# EAGLE design High Fructose (EAGLE 6.4)

## Sheet 1 of 5
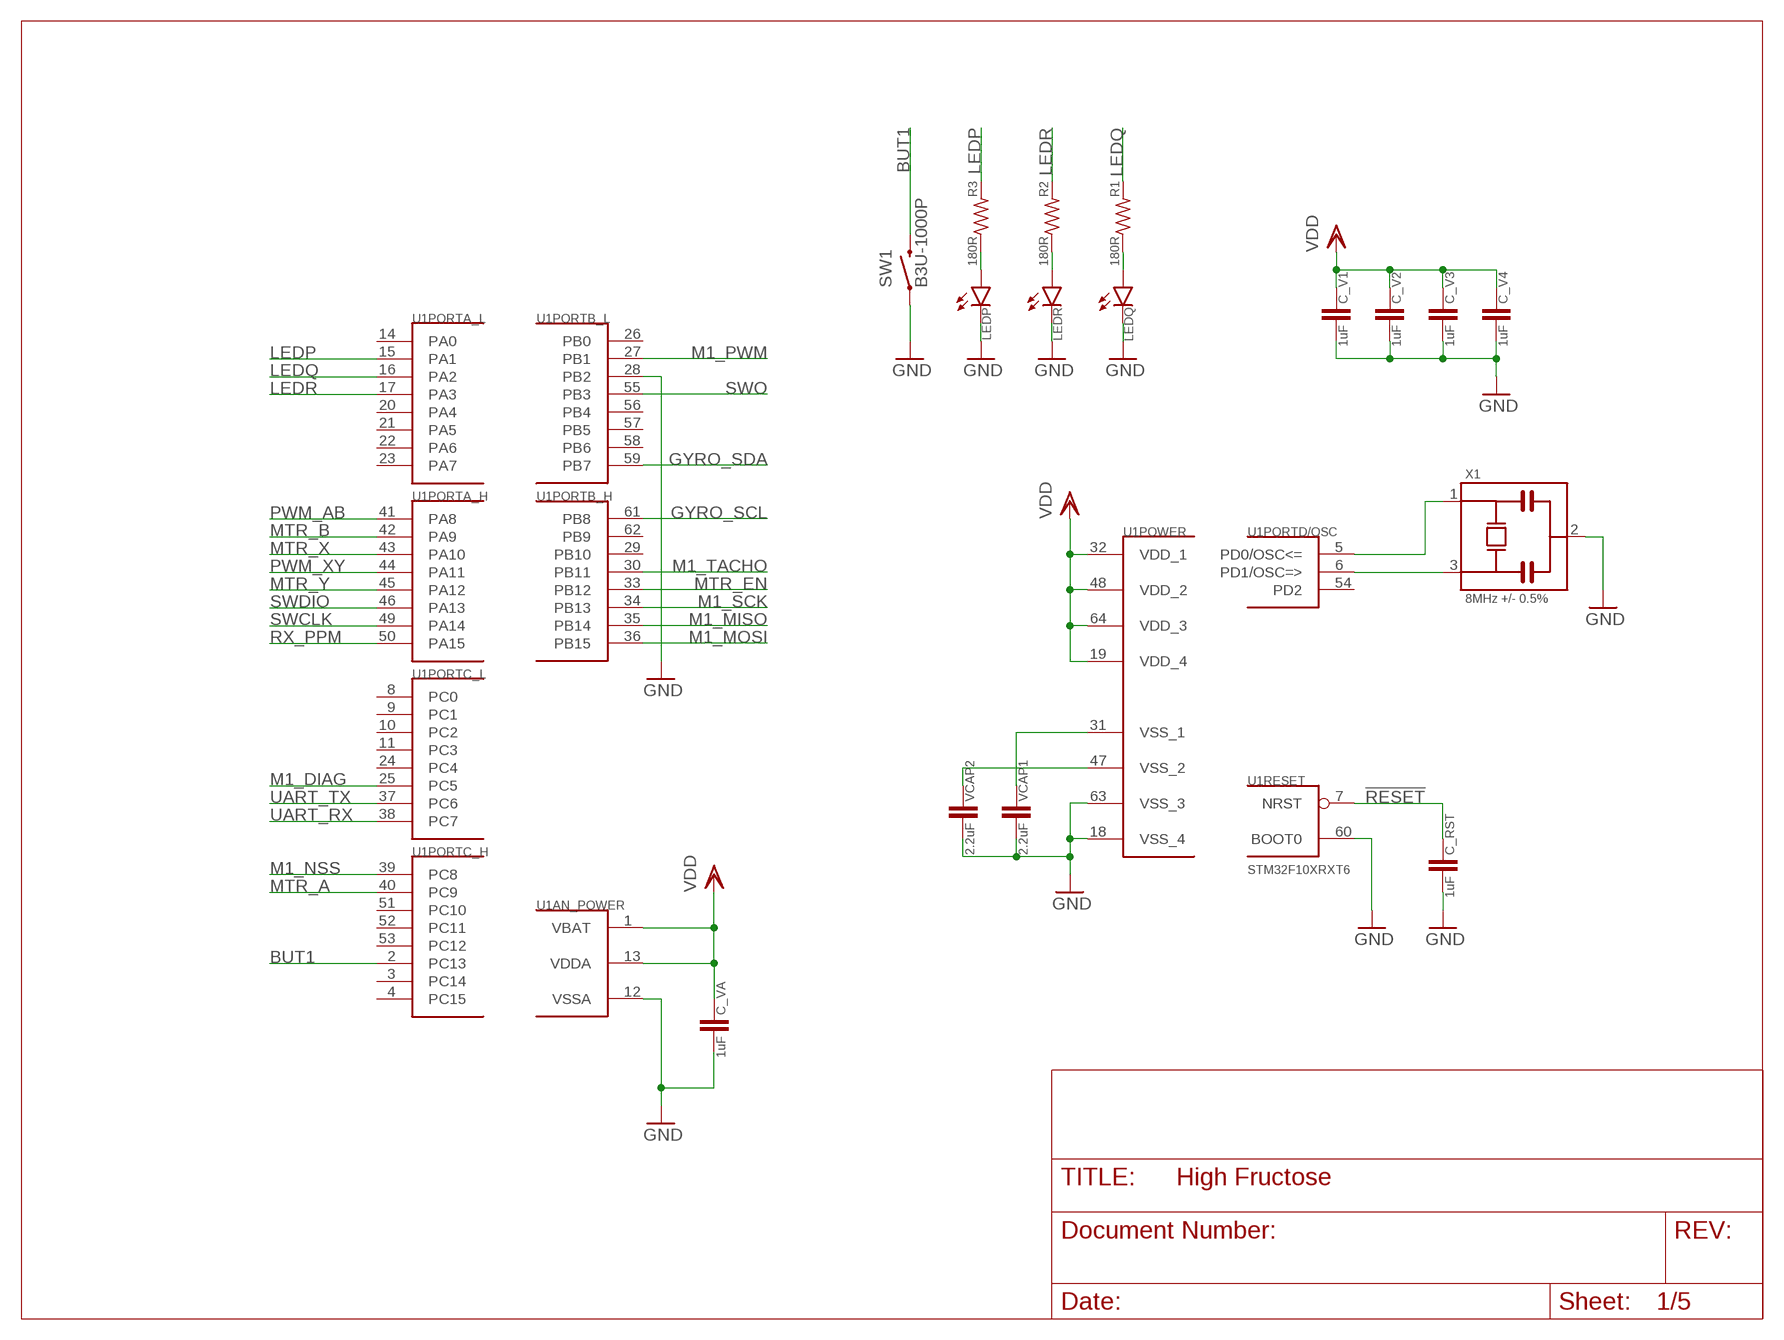
[diagram p0: schematic, sheet 1]

### Parts
C_RST  1uF  C0603  [0603]
C_V1  1uF  C0603  [0603]
C_V2  1uF  C0603  [0603]
C_V3  1uF  C0603  [0603]
C_V4  1uF  C0603  [0603]
C_VA  1uF  C0603  [0603]
LEDP  LED0805  [0805_POL]
LEDQ  LED0805  [0805_POL]
LEDR  LED0805  [0805_POL]
R1  180R  R0603  [0603]
R2  180R  R0603  [0603]
R3  180R  R0603  [0603]
SW1  B3U-1000P  SWITCH_SPST-NOB3U-1000P  [B3U-1000P]
U1  STM32F10XRXT6  [TQFP64]
VCAP1  2.2uF  C0603  [0603]
VCAP2  2.2uF  C0603  [0603]
X1  8MHz +/- 0.5%  MURATA_CSTCE  [MURATA_CSTCE]

### Nets
!RESET: C_RST.1 U1.7(RESET:NRST) ; also sheet 4,5
BUT1: SW1.2 U1.2(PORTC_H:PC13)
GND: C_RST.2 C_V1.2 C_V2.2 C_V3.2 C_V4.2 C_VA.2 LEDP.-(C) LEDQ.-(C) LEDR.-(C) SW1.1 U1.12(AN_POWER:VSSA) U1.18(POWER:VSS_4) U1.28(PORTB_L:PB2) U1.60(RESET:BOOT0) U1.63(POWER:VSS_3) VCAP1.2 VCAP2.2 X1.2 ; also sheet 2,4,5
GYRO_SCL: U1.61(PORTB_H:PB8) ; also sheet 5
GYRO_SDA: U1.59(PORTB_L:PB7) ; also sheet 5
LEDP: R3.2 U1.15(PORTA_L:PA1)
LEDQ: R1.2 U1.16(PORTA_L:PA2)
LEDR: R2.2 U1.17(PORTA_L:PA3)
M1_DIAG: U1.25(PORTC_L:PC5) ; also sheet 2
M1_MISO: U1.35(PORTB_H:PB14) ; also sheet 2
M1_MOSI: U1.36(PORTB_H:PB15) ; also sheet 2
M1_NSS: U1.39(PORTC_H:PC8) ; also sheet 2
M1_PWM: U1.27(PORTB_L:PB1) ; also sheet 2
M1_SCK: U1.34(PORTB_H:PB13) ; also sheet 2
M1_TACHO: U1.30(PORTB_H:PB11) ; also sheet 2
MTR_A: U1.40(PORTC_H:PC9) ; also sheet 3
MTR_B: U1.42(PORTA_H:PA9) ; also sheet 3
MTR_EN: U1.33(PORTB_H:PB12) ; also sheet 3
MTR_X: U1.43(PORTA_H:PA10) ; also sheet 3
MTR_Y: U1.45(PORTA_H:PA12) ; also sheet 3
N$1: U1.6(PORTD/OSC:PD1/OSC=>) X1.3
N$2: U1.5(PORTD/OSC:PD0/OSC<=) X1.1
N$3: U1.47(POWER:VSS_2) VCAP2.1
N$4: U1.31(POWER:VSS_1) VCAP1.1
N$5: LEDQ.+(A) R1.1
N$11: LEDP.+(A) R3.1
N$35: LEDR.+(A) R2.1
PWM_AB: U1.41(PORTA_H:PA8) ; also sheet 3
PWM_XY: U1.44(PORTA_H:PA11) ; also sheet 3
RX_PPM: U1.50(PORTA_H:PA15) ; also sheet 5
SWCLK: U1.49(PORTA_H:PA14) ; also sheet 5
SWDIO: U1.46(PORTA_H:PA13) ; also sheet 5
SWO: U1.55(PORTB_L:PB3) ; also sheet 5
UART_RX: U1.38(PORTC_L:PC7) ; also sheet 5
UART_TX: U1.37(PORTC_L:PC6) ; also sheet 5
VDD: C_V1.1 C_V2.1 C_V3.1 C_V4.1 C_VA.1 U1.1(AN_POWER:VBAT) U1.13(AN_POWER:VDDA) U1.19(POWER:VDD_4) U1.32(POWER:VDD_1) U1.48(POWER:VDD_2) U1.64(POWER:VDD_3) ; also sheet 2,4,5
Unconnected: U1.3(PORTC_H:PC14) U1.4(PORTC_H:PC15) U1.8(PORTC_L:PC0) U1.9(PORTC_L:PC1) U1.10(PORTC_L:PC2) U1.11(PORTC_L:PC3) U1.14(PORTA_L:PA0) U1.20(PORTA_L:PA4) U1.21(PORTA_L:PA5) U1.22(PORTA_L:PA6) U1.23(PORTA_L:PA7) U1.24(PORTC_L:PC4) U1.26(PORTB_L:PB0) U1.29(PORTB_H:PB10) U1.51(PORTC_H:PC10) U1.52(PORTC_H:PC11) U1.53(PORTC_H:PC12) U1.54(PORTD/OSC:PD2) U1.56(PORTB_L:PB4) U1.57(PORTB_L:PB5) U1.58(PORTB_L:PB6) U1.62(PORTB_H:PB9)

## Sheet 2 of 5
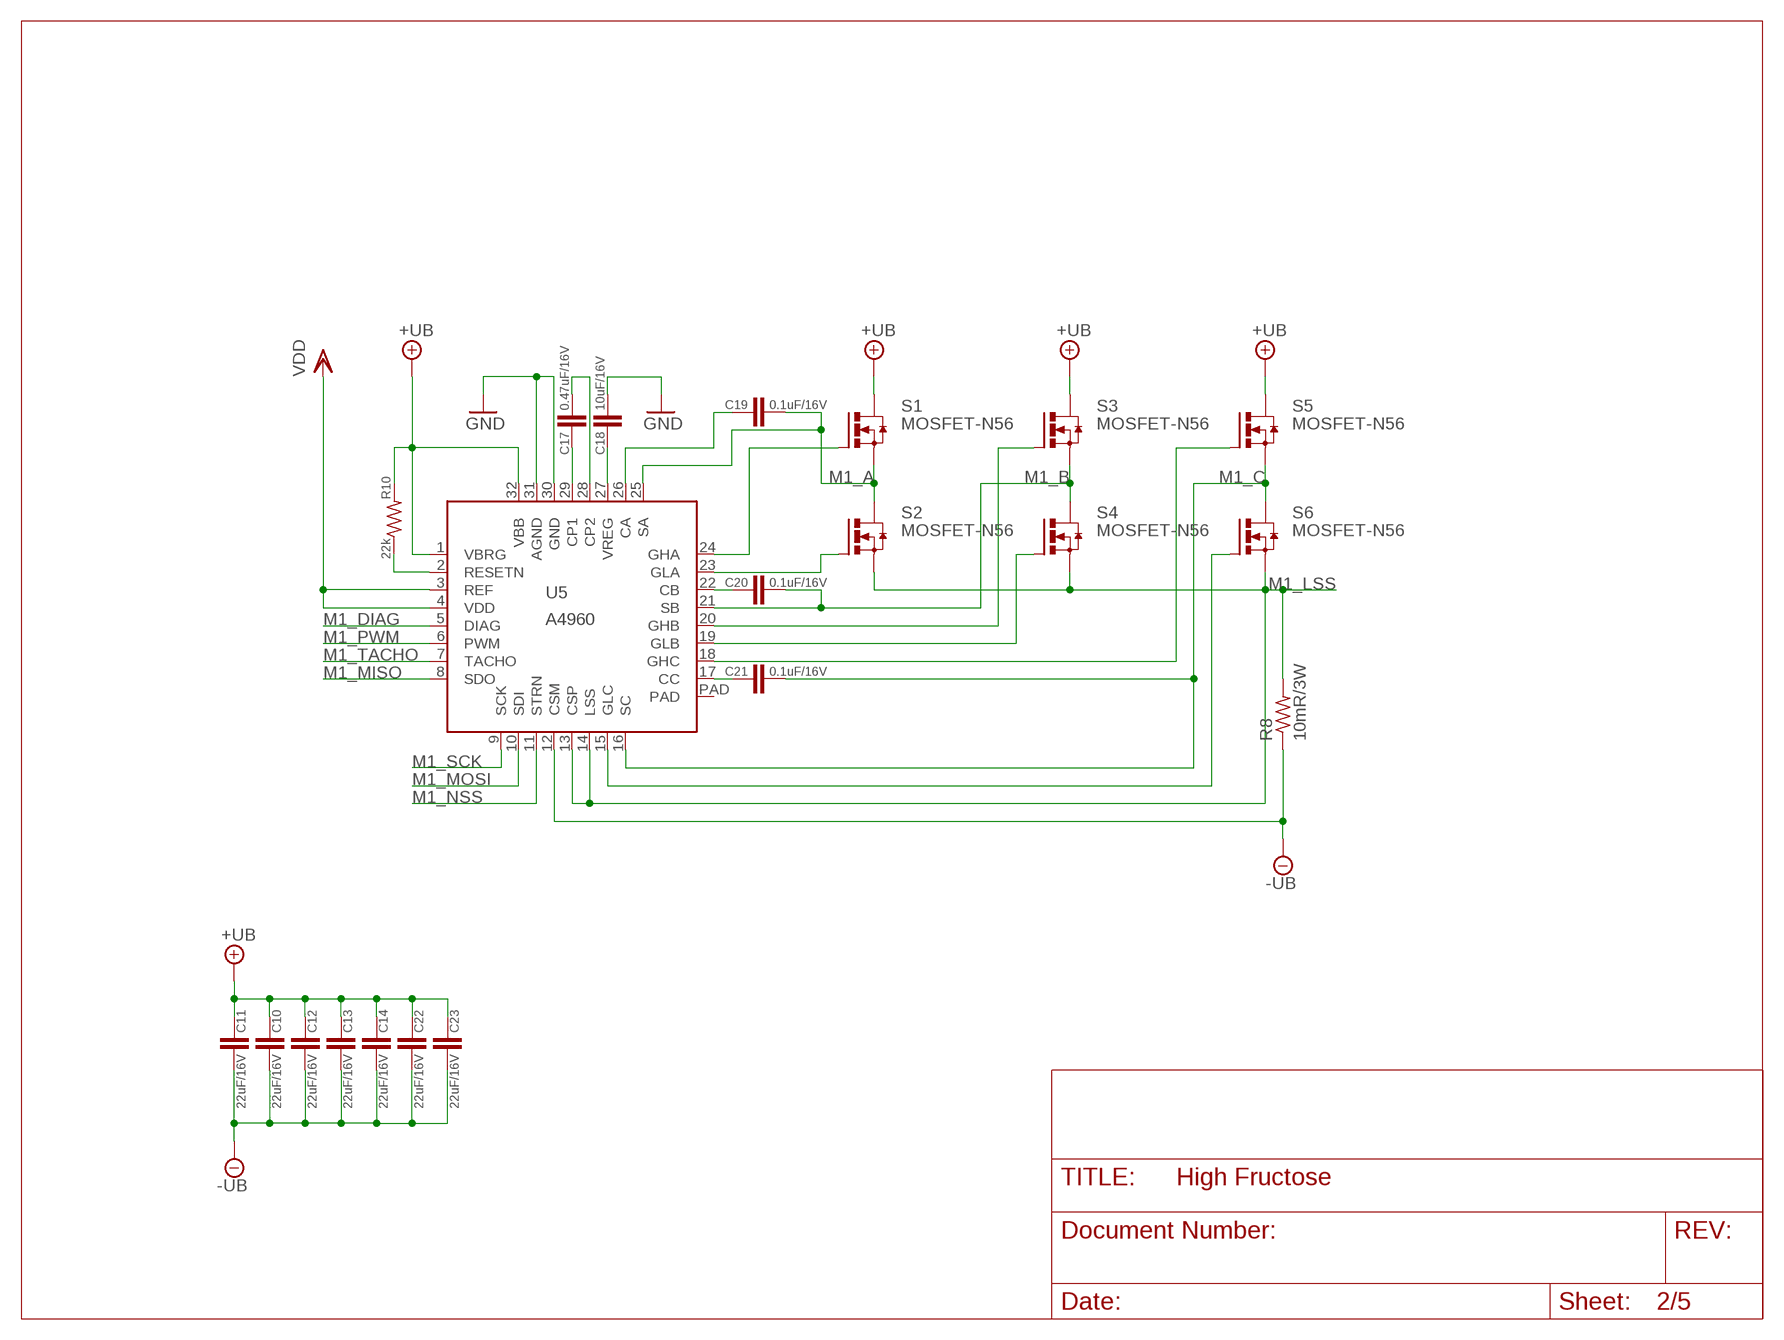
[diagram p1: schematic, sheet 2]

### Parts
C10  22uF/16V  C1206  [1206]
C11  22uF/16V  C1206  [1206]
C12  22uF/16V  C1206  [1206]
C13  22uF/16V  C1206  [1206]
C14  22uF/16V  C1206  [1206]
C17  0.47uF/16V  C0603  [0603]
C18  10uF/16V  C0805  [0805]
C19  0.1uF/16V  C0603  [0603]
C20  0.1uF/16V  C0603  [0603]
C21  0.1uF/16V  C0603  [0603]
C22  22uF/16V  C1206  [1206]
C23  22uF/16V  C1206  [1206]
R8  10mR/3W  R-US_R2512  [R2512]
R10  22k  R0603  [0603]
S1  MOSFET-N56  [SON-5X6]
S2  MOSFET-N56  [SON-5X6]
S3  MOSFET-N56  [SON-5X6]
S4  MOSFET-N56  [SON-5X6]
S5  MOSFET-N56  [SON-5X6]
S6  MOSFET-N56  [SON-5X6]
U5  A4960  [LQFP32-THERMPAD]

### Nets
+UB: C10.1 C11.1 C12.1 C13.1 C14.1 C22.1 C23.1 R10.2 S1.D S3.D S5.D U5.1(VBRG) U5.32(VBB)
-UB: C10.2 C11.2 C12.2 C13.2 C14.2 C22.2 C23.2 R8.1 U5.12(CSM)
GND: C18.2 U5.30(GND) U5.31(AGND) ; also sheet 1,4,5
M1_A: C19.2 S1.S1(S) S1.S2(S) S1.S3(S) S2.D U5.25(SA)
M1_B: C20.2 S3.S1(S) S3.S2(S) S3.S3(S) S4.D U5.21(SB)
M1_C: C21.2 S5.S1(S) S5.S2(S) S5.S3(S) S6.D U5.16(SC)
M1_DIAG: U5.5(DIAG) ; also sheet 1
M1_LSS: R8.2 S2.S1(S) S2.S2(S) S2.S3(S) S4.S1(S) S4.S2(S) S4.S3(S) S6.S1(S) S6.S2(S) S6.S3(S) U5.13(CSP) U5.14(LSS)
M1_MISO: U5.8(SDO) ; also sheet 1
M1_MOSI: U5.10(SDI) ; also sheet 1
M1_NSS: U5.11(STRN) ; also sheet 1
M1_PWM: U5.6(PWM) ; also sheet 1
M1_SCK: U5.9(SCK) ; also sheet 1
M1_TACHO: U5.7(TACHO) ; also sheet 1
N$24: C17.1 U5.29(CP1)
N$25: C17.2 U5.28(CP2)
N$26: C18.1 U5.27(VREG)
N$30: S1.G U5.24(GHA)
N$31: S2.G U5.23(GLA)
N$37: C19.1 U5.26(CA)
N$39: S3.G U5.20(GHB)
N$40: S4.G U5.19(GLB)
N$41: C20.1 U5.22(CB)
N$42: S5.G U5.18(GHC)
N$44: S6.G U5.15(GLC)
N$45: C21.1 U5.17(CC)
N$48: R10.1 U5.2(RESETN)
VDD: U5.3(REF) U5.4(VDD) ; also sheet 1,4,5
Unconnected: U5.PAD

## Sheet 3 of 5
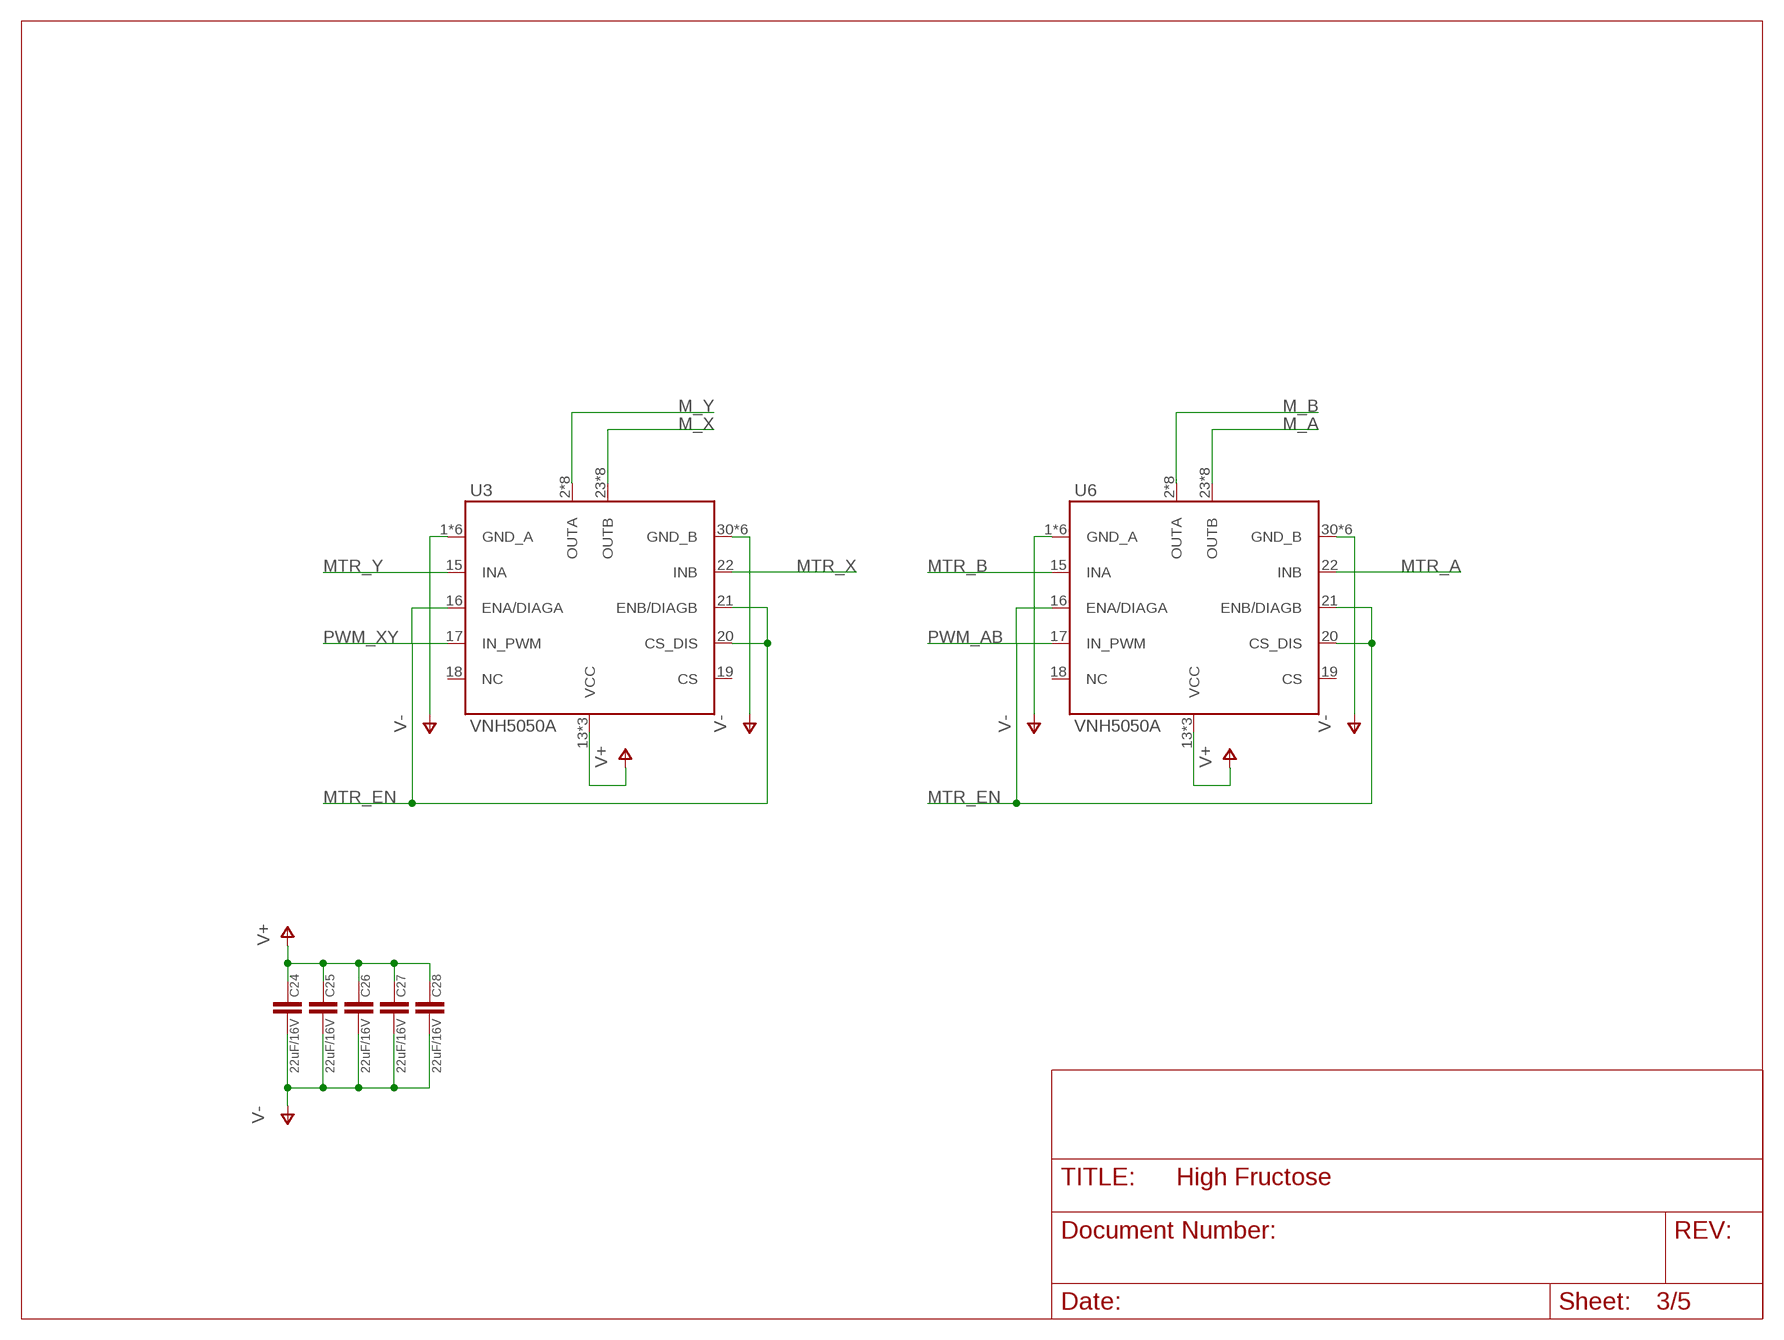
[diagram p2: schematic, sheet 3]

### Parts
C24  22uF/16V  C1206  [1206]
C25  22uF/16V  C1206  [1206]
C26  22uF/16V  C1206  [1206]
C27  22uF/16V  C1206  [1206]
C28  22uF/16V  C1206  [1206]
U3  VNH5050A  [POWERSSO-36]
U6  VNH5050A  [POWERSSO-36]

### Nets
M_A: U6.23(OUTB) U6.25(OUTB) U6.26(OUTB) U6.27(OUTB) U6.28(OUTB) U6.29(OUTB) U6.35(OUTB) U6.LS_B(OUTB)
M_B: U6.2(OUTA) U6.8(OUTA) U6.9(OUTA) U6.10(OUTA) U6.11(OUTA) U6.12(OUTA) U6.14(OUTA) U6.LS_A(OUTA)
M_X: U3.23(OUTB) U3.25(OUTB) U3.26(OUTB) U3.27(OUTB) U3.28(OUTB) U3.29(OUTB) U3.35(OUTB) U3.LS_B(OUTB)
M_Y: U3.2(OUTA) U3.8(OUTA) U3.9(OUTA) U3.10(OUTA) U3.11(OUTA) U3.12(OUTA) U3.14(OUTA) U3.LS_A(OUTA)
MTR_A: U6.22(INB) ; also sheet 1
MTR_B: U6.15(INA) ; also sheet 1
MTR_EN: U3.16(ENA/DIAGA) U3.20(CS_DIS) U3.21(ENB/DIAGB) U6.16(ENA/DIAGA) U6.20(CS_DIS) U6.21(ENB/DIAGB) ; also sheet 1
MTR_X: U3.22(INB) ; also sheet 1
MTR_Y: U3.15(INA) ; also sheet 1
PWM_AB: U6.17(IN_PWM) ; also sheet 1
PWM_XY: U3.17(IN_PWM) ; also sheet 1
V+: C24.1 C25.1 C26.1 C27.1 C28.1 U3.13(VCC) U3.24(VCC) U3.HS_AB(VCC) U6.13(VCC) U6.24(VCC) U6.HS_AB(VCC) ; also sheet 4
V-: C24.2 C25.2 C26.2 C27.2 C28.2 U3.1(GND_A) U3.3(GND_A) U3.4(GND_A) U3.5(GND_A) U3.6(GND_A) U3.7(GND_A) U3.30(GND_B) U3.31(GND_B) U3.32(GND_B) U3.33(GND_B) U3.34(GND_B) U3.36(GND_B) U6.1(GND_A) U6.3(GND_A) U6.4(GND_A) U6.5(GND_A) U6.6(GND_A) U6.7(GND_A) U6.30(GND_B) U6.31(GND_B) U6.32(GND_B) U6.33(GND_B) U6.34(GND_B) U6.36(GND_B) ; also sheet 4
Unconnected: U3.18(NC) U3.19(CS) U6.18(NC) U6.19(CS)

## Sheet 4 of 5
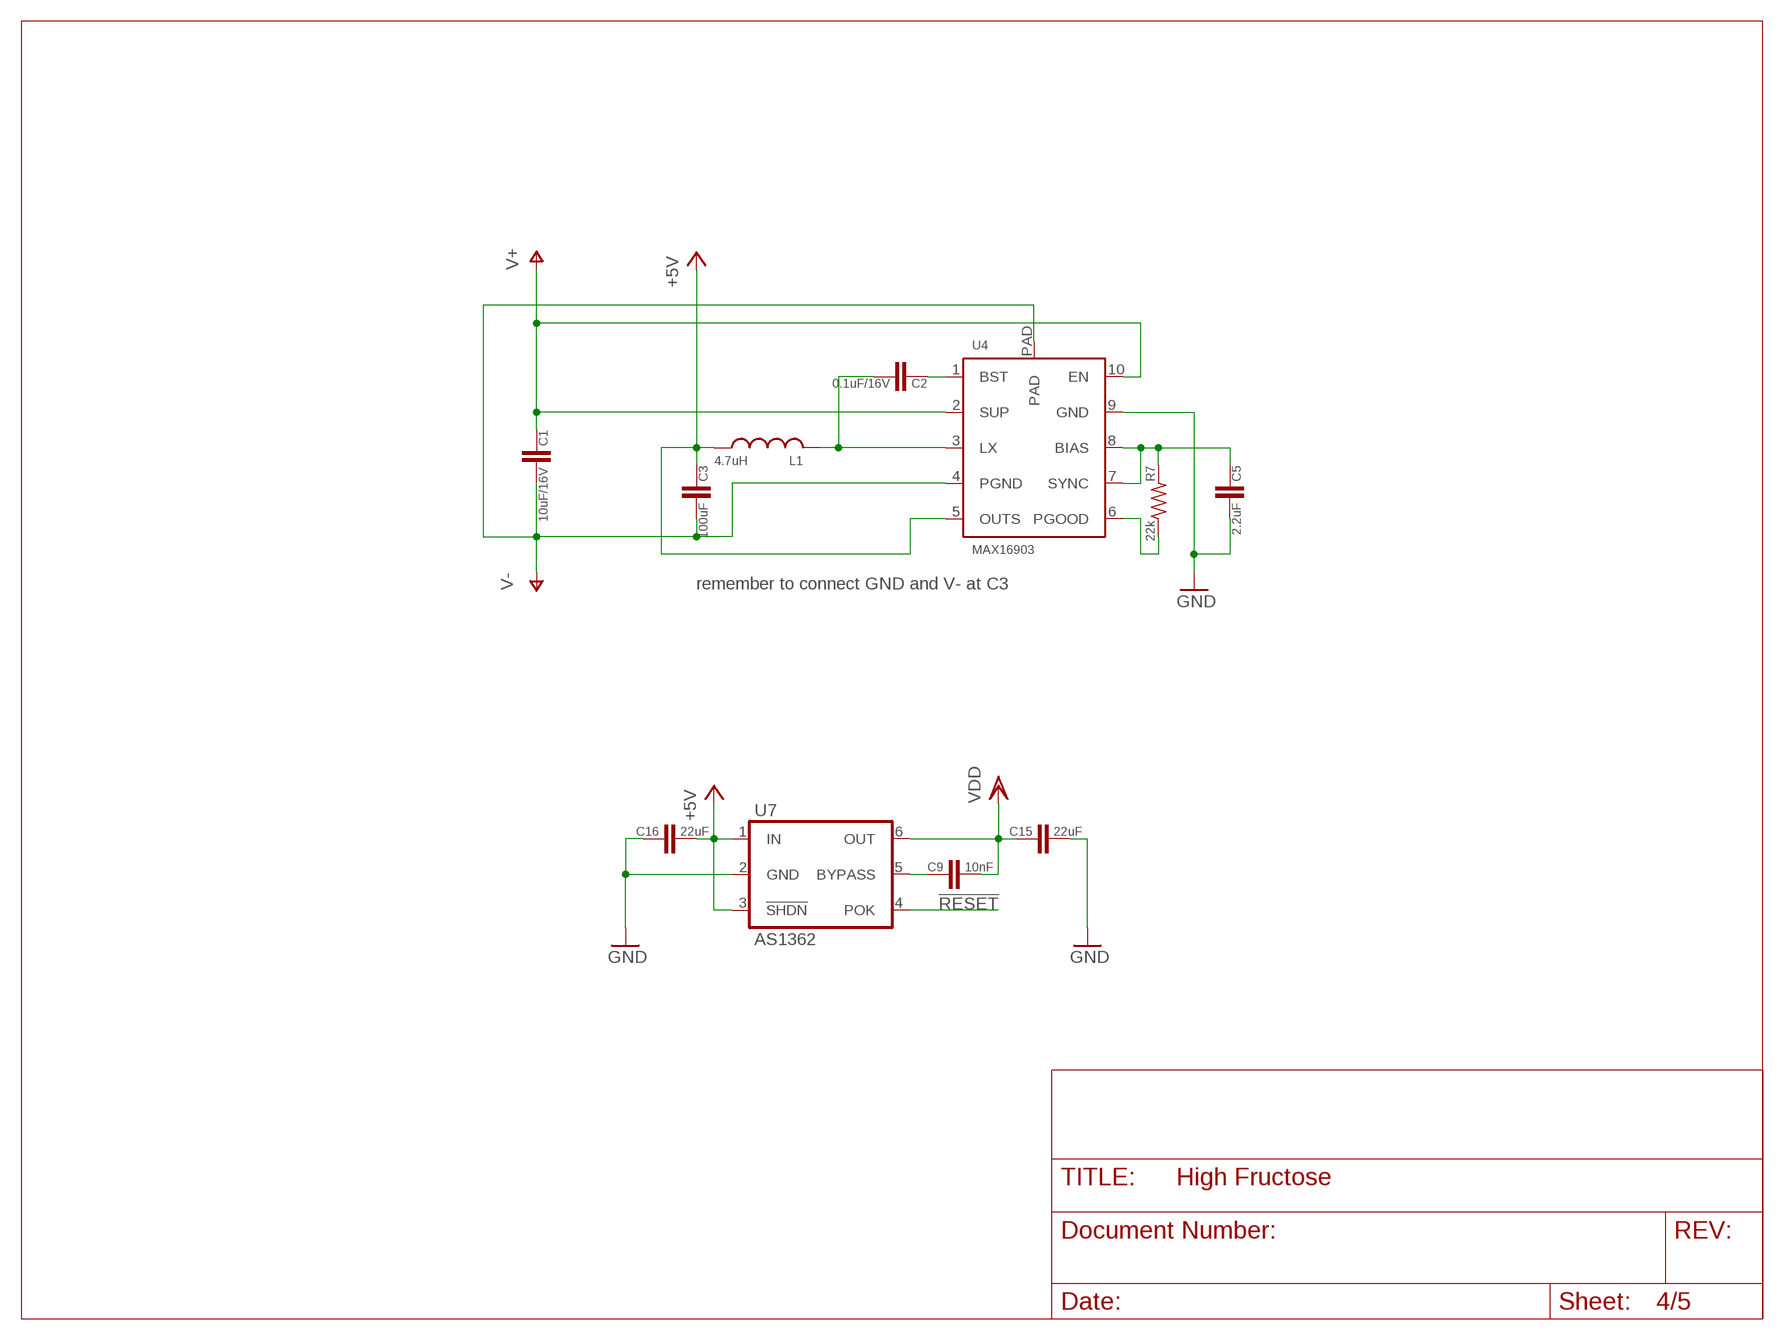
[diagram p3: schematic, sheet 4]

### Parts
C1  10uF/16V  C0805  [0805]
C2  0.1uF/16V  C0603  [0603]
C3  100uF  C1206  [1206]
C5  2.2uF  C0603  [0603]
C9  10nF  C0603  [0603]
C15  22uF  C0805  [0805]
C16  22uF  C0805  [0805]
L1  4.7uH  L-US_NR30  [TAIYO-YUDEN_NR30]
R7  22k  R0603  [0603]
U4  MAX16903  [TDFN-10]
U7  AS1362  [SOT23-6]

### Nets
!RESET: U7.4(POK) ; also sheet 1,5
+5V: C3.1 C16.2 L1.1 U4.5(OUTS) U7.1(IN) U7.3(!SHDN) ; also sheet 5
GND: C5.2 C15.2 C16.1 U4.9(GND) U7.2(GND) ; also sheet 1,2,5
N$8: C2.1 U4.1(BST)
N$9: C9.1 U7.5(BYPASS)
N$22: C2.2 L1.2 U4.3(LX)
N$28: C5.1 R7.2 U4.7(SYNC) U4.8(BIAS)
N$29: R7.1 U4.6(PGOOD)
V+: C1.1 U4.2(SUP) U4.10(EN) ; also sheet 3
V-: C1.2 C3.2 U4.4(PGND) U4.PAD ; also sheet 3
VDD: C9.2 C15.1 U7.6(OUT) ; also sheet 1,2,5

### Notes on the sheet
- remember to connect GND and V- at C3

## Sheet 5 of 5
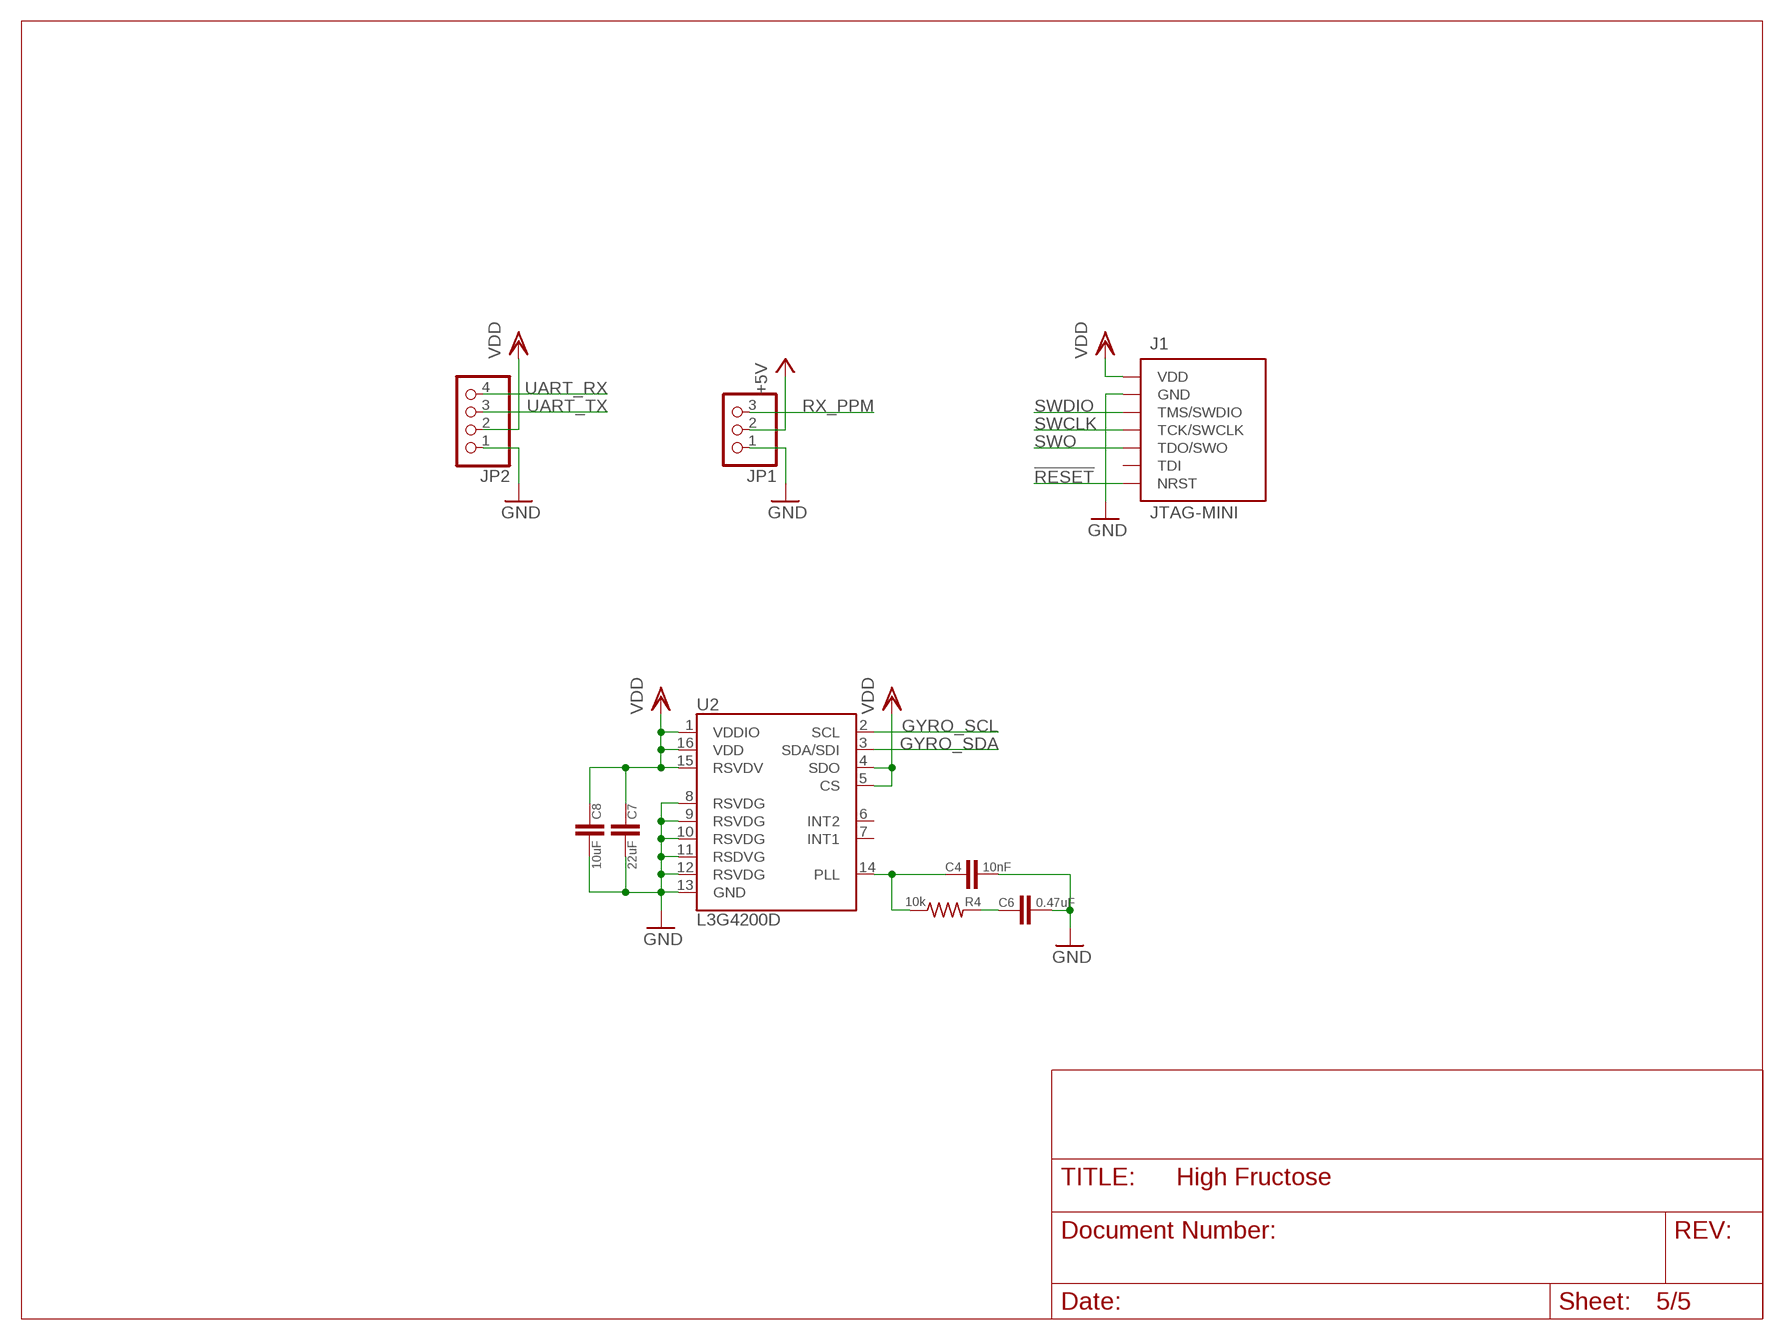
[diagram p4: schematic, sheet 5]

### Parts
C4  10nF  C0603  [0603]
C6  0.47uF  C0603  [0603]
C7  22uF  C0805  [0805]
C8  10uF  C0603  [0603]
J1  JTAG-MINI  [JTAG-MINI]
JP1  PINHD-1X03_2.54-S  [1X03-S]
JP2  PINHD-1X04_2.54-S  [1X04-S]
R4  10k  R0603  [0603]
U2  L3G4200D  [LGA16-4X4]

### Nets
!RESET: J1.NRST ; also sheet 1,4
+5V: JP1.2 ; also sheet 4
GND: C4.2 C6.2 C7.2 C8.2 J1.GND1(GND) J1.GND2(GND) J1.GND3(GND) J1.GND4(GND) JP1.1 JP2.1 U2.8(RSVDG) U2.9(RSVDG) U2.10(RSVDG) U2.11(RSDVG) U2.12(RSVDG) U2.13(GND) ; also sheet 1,2,4
GYRO_SCL: U2.2(SCL) ; also sheet 1
GYRO_SDA: U2.3(SDA/SDI) ; also sheet 1
N$6: C4.1 R4.1 U2.14(PLL)
N$7: C6.1 R4.2
RX_PPM: JP1.3 ; also sheet 1
SWCLK: J1.TCK(TCK/SWCLK) ; also sheet 1
SWDIO: J1.TMS(TMS/SWDIO) ; also sheet 1
SWO: J1.TDO(TDO/SWO) ; also sheet 1
UART_RX: JP2.4 ; also sheet 1
UART_TX: JP2.3 ; also sheet 1
VDD: C7.1 C8.1 J1.VDD JP2.2 U2.1(VDDIO) U2.4(SDO) U2.5(CS) U2.15(RSVDV) U2.16(VDD) ; also sheet 1,2,4
Unconnected: J1.TDI U2.6(INT2) U2.7(INT1)

## Library data of the parts
C1-C28 C_RST C_V1-C_V4 C_VA VCAP1 VCAP2 = dan-rcl:C
J1 = xow:JTAG
JP1 = pinhead-2:PINHD-1X03: PIN HEADER
JP2 = pinhead-2:PINHD-1X04: PIN HEADER
L1 = xow:L-US
LEDP LEDQ LEDR = dan-led:LED: LED
R1-R4 R7 R10 = dan-rcl:R
R8 = rcl:R-US_: RESISTOR, American symbol
S1-S6 = xow:MOSFET-N: Power NMOSFETs in: - D2PAK-7 - 5mm x 6mm (Power56/PQFN 5x6)
SW1 = xow:SWITCH_SPST-NO
U1 = stm32:STM32F10XRXT6: STM32F101/103 64pin LQFP
U2 = SparkFun-Sensors:L3G4200D: L3G4200D Three-axis, digital output gyroscope The L3G4200D is a low-power three-axis angular rate sensor, has a full scale of ±250/±500/±2000 dps and is capable of measuring rates with a user-selectable bandwidth. It includes a sensing element and an IC interface capable of providing the measured angular rate to the external world through a digital interface (I2C/SPI). Package: 4x4x1.1 LGA-16 (LGA16-4x4.PAC)
U3 U6 = Xo-PowerIC:VNH5050A: 18V H-bridge capable of switching at 20kHz
U4 = xow:MAX16903
U5 = xow:A4960
U7 = Xo-VReg:AS1362: AMS AS1361/AS1362
X1 = xow:MURATA_CSTCE

## Board
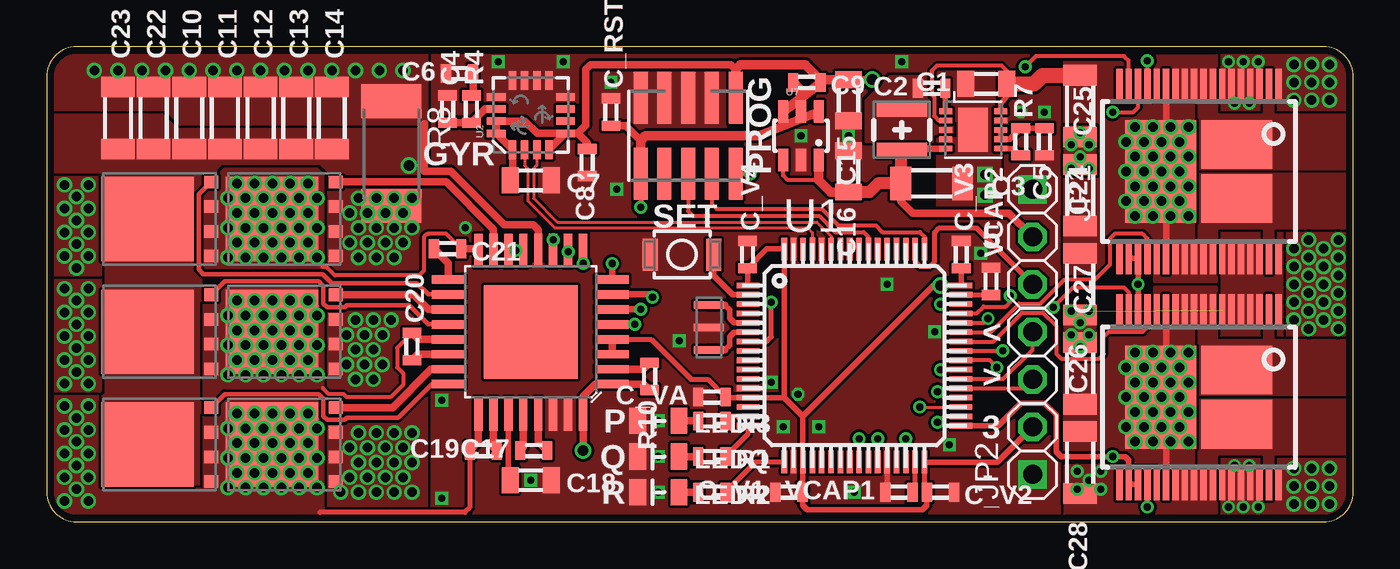
[diagram p5: board, top side]
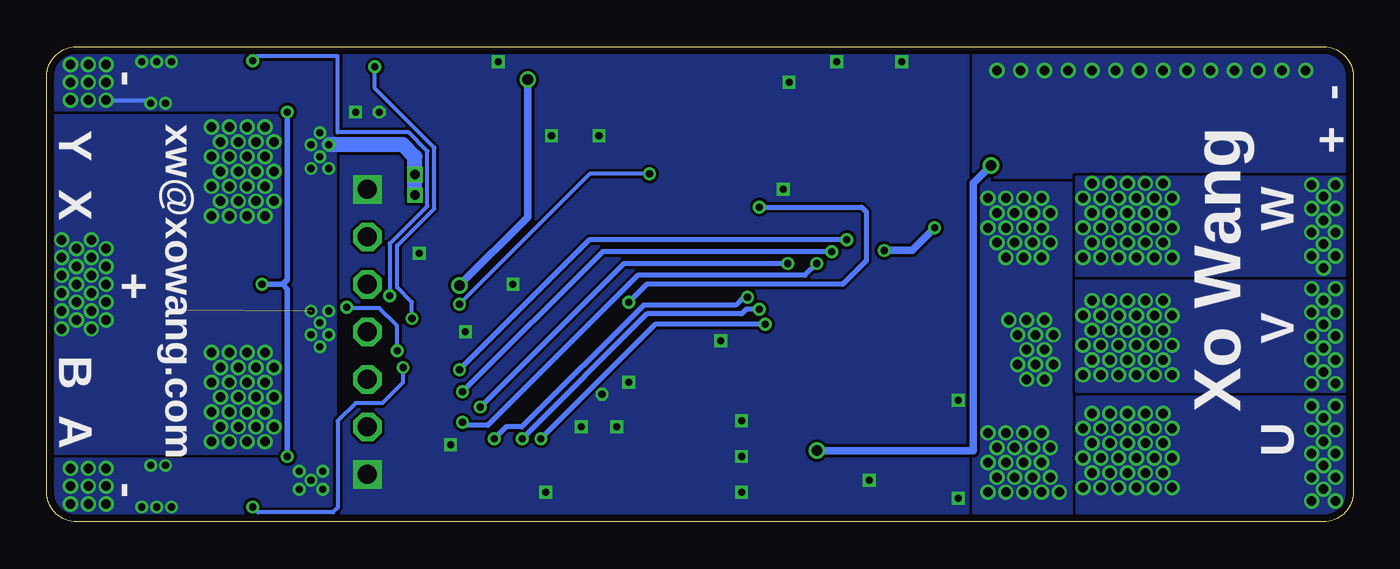
[diagram p6: board, bottom side, seen from below]

Size 69.85 x 25.4 mm. Coordinates in mm from the lower left corner, seen from the top.
Outline: 0,23.81 0,1.59 arc90 1.59,0 68.26,0 arc90 69.85,1.59 69.85,23.81 arc90 68.26,25.4 1.59,25.4 arc90 0,23.81
Copper layers (1*16): Top 0.0356mm / dielectric 1.5288mm / Bottom 0.0356mm
Design rules: minimum track width 6mil, minimum drill 13mil, track to track 6mil, track to pad 6mil, pad to pad 6mil, via to via 6mil, smd to smd 0mil, copper to edge 15mil, drill to drill 6mil, minimum pad ring 7mil, minimum via ring 6mil, stop-mask expansion 4mil, vias tented up to drill 23mil, thermal gap 10mil

### Footprints (pad centres in the part's own frame; a part is rotated, then mirrored left to right if it is on the bottom)
0805 = smd 0.9 x 1.4: 1 -1.1,0; 2 1.1,0
0603 = smd 0.55 x 1: 1 -0.725,0; 2 0.725,0
1206 = smd 1.1 x 1.8: 1 -1.65,0; 2 1.65,0
JTAG-MINI = smd 0.737 x 2.794: GND1 -1.27,-2.032; GND2 0,-2.032; GND3 1.27,-2.032; GND4 2.54,-2.032; NRST 2.54,2.032; TCK -1.27,2.032; TDI 1.27,2.032; TDO 0,2.032; TMS -2.54,2.032; VDD -2.54,-2.032
1X03-S = drill 1.016 square: 1 -2.54,0 | drill 1.016 octagon: 2 0,0; 3 2.54,0
1X04-S = drill 1.016 square: 1 -3.81,0 | drill 1.016 octagon: 2 -1.27,0; 3 1.27,0; 4 3.81,0
TAIYO-YUDEN_NR30 = smd 0.8 x 2.7: 1 -1.1,0; 2 1.1,0
0805_POL = smd 0.9 x 1.4: + 1.1,0; - -1.1,0
R2512 = smd 1.8 x 3.2: 1 -2.8,0; 2 2.8,0
SON-5X6 = smd 4.95 x 4.51: D -0.652,0 | smd 0.75 x 0.675: G 2.752,1.98; S1 2.752,-1.98; S2 2.752,-0.66; S3 2.752,0.66
B3U-1000P = smd 0.8 x 1.7: 1 1.7,0; 2 -1.7,0
TQFP64 = smd 1.2 x 0.3: 1 -5.7,3.75; 2 -5.7,3.25; 3 -5.7,2.75; 4 -5.7,2.25; 5 -5.7,1.75; 6 -5.7,1.25; 7 -5.7,0.75; 8 -5.7,0.25; 9 -5.7,-0.25; 10 -5.7,-0.75; 11 -5.7,-1.25; 12 -5.7,-1.75; 13 -5.7,-2.25; 14 -5.7,-2.75; 15 -5.7,-3.25; 16 -5.7,-3.75; 33 5.7,-3.75; 34 5.7,-3.25; 35 5.7,-2.75; 36 5.7,-2.25; 37 5.7,-1.75; 38 5.7,-1.25; 39 5.7,-0.75; 40 5.7,-0.25; 41 5.7,0.25; 42 5.7,0.75; 43 5.7,1.25; 44 5.7,1.75; 45 5.7,2.25; 46 5.7,2.75; 47 5.7,3.25; 48 5.7,3.75 | smd 0.3 x 1.2: 17 -3.75,-5.7; 18 -3.25,-5.7; 19 -2.75,-5.7; 20 -2.25,-5.7; 21 -1.75,-5.7; 22 -1.25,-5.7; 23 -0.75,-5.7; 24 -0.25,-5.7; 25 0.25,-5.7; 26 0.75,-5.7; 27 1.25,-5.7; 28 1.75,-5.7; 29 2.25,-5.7; 30 2.75,-5.7; 31 3.25,-5.7; 32 3.75,-5.7; 49 3.75,5.7; 50 3.25,5.7; 51 2.75,5.7; 52 2.25,5.7; 53 1.75,5.7; 54 1.25,5.7; 55 0.75,5.7; 56 0.25,5.7; 57 -0.25,5.7; 58 -0.75,5.7; 59 -1.25,5.7; 60 -1.75,5.7; 61 -2.25,5.7; 62 -2.75,5.7; 63 -3.25,5.7; 64 -3.75,5.7
LGA16-4X4 = smd 1 x 0.4: 1 -1.85,0.975; 2 -1.85,0.325; 3 -1.85,-0.325; 4 -1.85,-0.975; 9 1.85,-0.975; 10 1.85,-0.325; 11 1.85,0.325; 12 1.85,0.975 | smd 0.4 x 1: 5 -0.975,-1.85; 6 -0.325,-1.85; 7 0.325,-1.85; 8 0.975,-1.85; 13 0.975,1.85; 14 0.325,1.85; 15 -0.325,1.85; 16 -0.975,1.85
POWERSSO-36 = smd 0.34 x 1.7: 1 -4.25,-4.65; 2 -3.75,-4.65; 3 -3.25,-4.65; 4 -2.75,-4.65; 5 -2.25,-4.65; 6 -1.75,-4.65; 7 -1.25,-4.65; 8 -0.75,-4.65; 9 -0.25,-4.65; 10 0.25,-4.65; 11 0.75,-4.65; 12 1.25,-4.65; 13 1.75,-4.65; 14 2.25,-4.65; 15 2.75,-4.65; 16 3.25,-4.65; 17 3.75,-4.65; 18 4.25,-4.65; 19 4.25,4.65; 20 3.75,4.65; 21 3.25,4.65; 22 2.75,4.65; 23 2.25,4.65; 24 1.75,4.65; 25 1.25,4.65; 26 0.75,4.65; 27 0.25,4.65; 28 -0.25,4.65; 29 -0.75,4.65; 30 -1.25,4.65; 31 -1.75,4.65; 32 -2.25,4.65; 33 -2.75,4.65; 34 -3.25,4.65; 35 -3.75,4.65; 36 -4.25,4.65 | smd 3.8 x 5.5: HS_AB 2.025,0 | smd 3.8 x 2.6: LS_A -2.025,-1.45; LS_B -2.025,1.45
TDFN-10 = smd 0.3 x 0.7: 1 1,1.475; 2 0.5,1.475; 3 0,1.475; 4 -0.5,1.475; 5 -1,1.475; 6 -1,-1.475; 7 -0.5,-1.475; 8 0,-1.475; 9 0.5,-1.475; 10 1,-1.475 | smd 2.35 x 1.58: PAD 0,0
LQFP32-THERMPAD = smd 1.8 x 0.45: 1 -4.35,2.8; 2 -4.35,2; 3 -4.35,1.2; 4 -4.35,0.4; 5 -4.35,-0.4; 6 -4.35,-1.2; 7 -4.35,-2; 8 -4.35,-2.8; 17 4.4,-2.8; 18 4.4,-2; 19 4.4,-1.2; 20 4.4,-0.4; 21 4.4,0.4; 22 4.4,1.2; 23 4.4,2; 24 4.4,2.8 | smd 0.45 x 1.8: 9 -2.8,-4.35; 10 -2,-4.35; 11 -1.2,-4.35; 12 -0.4,-4.35; 13 0.4,-4.35; 14 1.2,-4.35; 15 2,-4.35; 16 2.8,-4.35; 25 2.8,4.4; 26 2,4.4; 27 1.2,4.4; 28 0.4,4.4; 29 -0.4,4.4; 30 -1.2,4.4; 31 -2,4.4; 32 -2.8,4.4 | smd 5 x 5: PAD 0,0
SOT23-6 = smd 0.55 x 1.2: 1 -0.95,-1.3; 2 0,-1.3; 3 0.95,-1.3; 4 0.95,1.3; 5 0,1.3; 6 -0.95,1.3
MURATA_CSTCE = smd 0.4 x 1.6: 1 -1.2,0; 2 0,0; 3 1.2,0

### Placement (x,y rotation side)
C1  50.23,23.42 180 top
C2  47.31,23.18 180 top
C3  47.31,18.1 0 top
C4  21.43,22.07 90 top
C5  53.34,20.32 270 top
C6  22.07,23.97 180 top
C7  25.88,18.26 0 top
C8  28.89,19.21 270 top
C9  40.64,23.5 0 top
C10  7.62,21.59 90 top
C11  9.53,21.59 90 top
C12  11.43,21.59 90 top
C13  13.34,21.59 90 top
C14  15.24,21.59 90 top
C15  42.86,22.54 270 top
C16  42.86,18.73 270 top
C17  26.04,3.81 180 top
C18  25.88,2.22 0 top
C19  23.34,3.81 180 top
C20  19.53,9.37 90 top
C21  21.43,14.61 0 top
C22  5.71,21.59 90 top
C23  3.81,21.59 90 top
C24  55.24,22.23 270 top
C25  55.24,17.46 90 top
C26  55.24,12.7 270 top
C27  55.24,7.94 90 top
C28  55.24,3.17 270 top
C_RST  30.16,21.91 90 top
C_V1  39.69,1.59 180 top
C_V2  47.78,1.59 0 top
C_V3  48.9,14.29 90 top
C_V4  37.47,14.29 90 top
C_VA  35.56,6.67 180 top
J1  34.29,20.64 180 top
JP1  52.7,15.24 270 top
JP2  52.7,6.35 90 top
L1  45.72,20.95 90 top
LEDP  32.7,5.4 0 top
LEDQ  32.7,3.49 0 top
LEDR  32.7,1.59 0 top
R1  35.56,3.49 0 top
R2  35.56,1.59 0 top
R3  35.56,5.4 0 top
R4  22.7,22.07 90 top
R7  52.07,20.32 90 top
R8  18.41,19.68 270 top
R10  32.23,7.78 270 top
S1  6.03,4.13 0 top
S2  12.7,4.13 0 top
S3  6.03,10.16 0 top
S4  12.7,10.16 0 top
S5  6.03,16.19 0 top
S6  12.7,16.19 0 top
SW1  33.97,14.29 180 top
U1  43.18,8.89 0 top
U2  25.88,21.75 90 top
U3  61.59,18.73 180 top
U4  49.53,20.95 90 top
U5  25.88,10.16 180 top
U6  61.59,6.67 180 top
U7  40.32,20.64 0 top
VCAP1  45.56,1.59 180 top
VCAP2  50.48,12.86 90 top
X1  35.4,10.39 270 top

### Tracks (layer width: path | path; a pad name or v marks a point on that pad's centre or on a via)
!RESET  (via drill 0.38)
  Top 0.254: J1.NRST v31.75,16.83 | U1.7 38.48,9.64 38.73,9.89 v38.73,11.75
  Top 0.406: 31.75,20.38 30.95,21.18 C_RST.1
  Top 0.508: U7.4 38.07,20.64 32,20.64 31.75,20.38 J1.NRST
  Bottom 0.254: v31.75,16.83 26.29,16.83 26.04,16.57 26.04,13.97 27.3,12.7 37.78,12.7 v38.73,11.75
+5V
  Top 0.203: 41.27,18.27 39.63,18.27 39.37,18.52 U7.1
  Top 0.356: U4.5 45.82,19.95 L1.1
  Top 0.406: C3.1 45.66,17.14 46.29,16.51 51.44,16.51 JP1.2
  Top 0.508: U7.3 41.27,18.27 41.91,17.63 C16.2
  Top 0.635: L1.1 45.66,19.79 C3.1 44.45,18.1 43.98,17.63 C16.2
+UB  (via drill 0.57)
  Top 0.406: R10.2 31.92,7.36 U5.1 29.31,7.36 28.68,6.72 U5.32 v28.68,3.81
  Bottom 0.406: v28.68,3.81 20.32,3.81 20.32,18.1 v19.37,19.05
  pour Top (rank 4, no thermals): 20.32,20.95 6.99,20.95 6.19,21.75 0,21.75 0,18.41 2.86,18.41 2.86,1.91 8.26,1.91 8.26,18.41 20.32,18.41
-UB  (via drill 0.51)
  Top 0.406: U5.12 26.28,15.62 26.02,15.88 24.45,15.88 21.59,18.73 20.19,18.73 20.19,21.27
  other vias: 2.54,24.13 5.08,24.13 7.62,24.13 10.16,24.13 15.24,24.13 12.7,24.13 17.78,24.13 3.81,24.13 6.35,24.13 8.89,24.13 11.43,24.13 16.51,24.13 13.97,24.13 19.05,24.13
  pour Top (rank 5, no thermals): 0,25.4 20.32,25.4 20.32,20.95 6.99,20.95 6.19,21.75 0,21.75
  pour Bottom (rank 4, no thermals): 0,25.4 20.32,25.4 20.32,18.41 0,18.41
  pour Top (rank 6, no thermals): 26.51,13.81 26.51,13.18 26.04,13.18 26.04,13.81
BUT1
  Top 0.305: SW1.2 35.67,13.16 36.69,12.14 U1.2
GND  (via drill 0.38)
  Top 0.305: VCAP1.2 44.93,1.68 U1.28
  other vias: 38.73,7.46 21.11,6.51 45.72,24.61 24.13,24.61 44.93,12.7 30.48,17.78 33.81,9.68 47.47,10.16 53.34,21.91 43.18,1.59 25.88,2.22 32.7,3.49 32.7,5.4 49.93,14.37 42.86,20.64 40.32,20.64 30.16,23.5 27.62,24.61 32.7,1.59 21.11,1.27 52.07,21.91 48.26,4.13 40.16,6.83 39.37,5.08 41.27,5.08
  pour Top (rank 6, no thermals): 20.32,25.4 54.13,25.4 54.13,0 20.32,0
  pour Bottom (rank 6, no thermals): 20.32,25.4 54.13,25.4 54.13,0 20.32,0
GYRO_SCL
  Top 0.152: U2.2 25.55,19.06 25.72,18.89 25.72,17.16 27.17,15.72 40.68,15.72 40.93,15.46 U1.61
GYRO_SDA
  Top 0.152: U2.3 26.2,19.06 26.03,18.89 26.03,17.29 27.3,16.02 41.17,16.02 41.93,15.26 U1.59
LEDP
  Top 0.254: U1.15 36.53,5.64 R3.2
LEDQ
  Top 0.254: U1.16 37.48,4.69 R1.2
LEDR
  Top 0.254: U1.17 37.89,3.19 R2.2
M1_A  (via drill 0.51)
  Top 0.254: C19.2 22.61,0.76 22.36,0.51 14.61,0.51
  Top 0.406: C19.2 23.08,4.28 U5.25
  other vias: 0.95,6.19 2.22,6.19 1.59,5.56 2.22,4.92 0.95,4.92 1.59,4.29 2.22,3.65 0.95,3.65 1.59,3.02 2.22,2.38 0.95,2.38 1.59,1.75 0.95,1.11 2.22,1.11 13.97,5.79 13.02,5.79 12.06,5.79 11.11,5.79 10.16,5.79 14.45,5 13.49,5 12.54,5 11.59,5 10.64,5 9.68,5 10.16,4.21 11.11,4.21 12.06,4.21 13.02,4.21 13.97,4.21 14.45,3.41 13.49,3.41 12.54,3.41 11.59,3.41 10.64,3.41 9.68,3.41 10.16,2.62 11.11,2.62 12.06,2.62 13.02,2.62 13.97,2.62 14.45,1.83 13.49,1.83 12.54,1.83 11.59,1.83 10.64,1.83 9.68,1.83
  pour Top (rank 3, no thermals): 8.41,5.71 8.57,5.71 9.53,6.67 14.76,6.67 14.76,0 0,0 0,6.99 2.71,6.99 2.71,1.75 8.41,1.75
  pour Bottom (rank 3, no thermals): 0,6.99 14.76,6.99 14.76,0 0,0
M1_B  (via drill 0.51)
  Top 0.203: C20.2 18.73,9.3 18.73,8.26 19.05,7.94 19.05,7.33 18.39,6.67 16.03,6.67 15.88,6.83 15.08,6.83 14.76,7.14
  Top 0.406: C20.2 19.86,9.76 U5.21
  other vias: 0.95,12.47 2.22,12.47 1.59,11.83 2.22,11.2 0.95,11.2 1.59,10.56 2.22,9.93 0.95,9.93 1.59,9.29 2.22,8.66 0.95,8.66 1.59,8.02 2.22,7.39 0.95,7.39 13.97,11.83 13.02,11.83 12.06,11.83 11.11,11.83 10.16,11.83 14.45,11.03 13.49,11.03 12.54,11.03 11.59,11.03 10.64,11.03 9.68,11.03 10.16,10.24 11.11,10.24 12.06,10.24 13.02,10.24 13.97,10.24 14.45,9.45 13.49,9.45 12.54,9.45 11.59,9.45 10.64,9.45 9.68,9.45 10.16,8.65 11.11,8.65 12.06,8.65 13.02,8.65 13.97,8.65 14.45,7.86 13.49,7.86 12.54,7.86 11.59,7.86 10.64,7.86 9.68,7.86
  pour Top (rank 3, no thermals): 8.41,11.91 8.57,11.91 9.53,12.86 14.45,12.86 14.76,12.54 14.76,6.83 9.37,6.83 8.41,5.87
  pour Bottom (rank 2, no thermals): 14.76,13.18 0,13.18 0,6.99 14.76,6.99
  pour Top (rank 2, no thermals): 0,13.18 2.86,13.18 2.86,6.99 0,6.99
M1_C  (via drill 0.51)
  Top 0.203: C21.2 21.36,15.4 20.41,15.4 arc90 20.16,15.14 20.16,13.43 19.91,13.18 15.4,13.18 14.96,13.61 14.73,13.61
  Top 0.406: C21.2 22.98,14.61 U5.16
  other vias: 0.95,18.02 2.22,18.02 1.59,17.38 2.22,16.75 0.95,16.75 1.59,16.11 2.22,15.48 0.95,15.48 1.59,14.84 2.22,14.21 0.95,14.21 1.59,13.57 13.97,18.1 13.02,18.1 12.06,18.1 11.11,18.1 10.16,18.1 14.45,17.3 13.49,17.3 12.54,17.3 11.59,17.3 10.64,17.3 9.68,17.3 10.16,16.51 11.11,16.51 12.06,16.51 13.02,16.51 13.97,16.51 14.45,15.72 13.49,15.72 12.54,15.72 11.59,15.72 10.64,15.72 9.68,15.72 10.16,14.92 11.11,14.92 12.06,14.92 13.02,14.92 13.97,14.92 14.45,14.13 13.49,14.13 12.54,14.13 11.59,14.13 10.64,14.13 9.68,14.13
  pour Top (no thermals): 8.41,18.41 9.05,18.41 9.53,18.89 14.45,18.89 14.76,18.57 14.76,12.86 9.53,12.86 8.73,12.06 8.41,12.06
  pour Bottom (no thermals): 14.76,18.41 0,18.41 0,13.18 14.76,13.18
  pour Top (no thermals): 0,18.41 2.86,18.41 2.86,13.18 0,13.18
M1_DIAG  (via drill 0.38)
  Top 0.254: U1.25 v43.43,4.45
  Top 0.356: U5.5 v31.43,10.56
  Bottom 0.254: v31.43,10.56 37.31,10.56 v43.43,4.45
M1_LSS  (via drill 0.38, 0.51)
  Top 0.406: U5.14 v25.08,14.51 U5.13
  Bottom 0.406: v25.08,14.51 23.59,14.51 v22.38,15.72
  other vias: 19.53,17.3 18.57,17.3 17.62,17.3 18.1,16.51 19.05,16.51 16.67,17.3 17.14,16.51 16.19,16.51 16.67,15.72 17.62,15.72 18.57,15.72 19.53,15.72 19.05,14.92 18.1,14.92 17.14,14.92 16.19,14.92 16.67,14.13 17.62,14.13 18.57,14.13 18.41,10.79 17.46,10.79 16.51,10.79 16.99,10 17.94,10 16.51,9.21 17.46,9.21 17.94,8.41 16.99,8.41 16.51,7.62 17.46,7.62 16.03,8.41 16.03,10 19.53,4.76 18.57,4.76 17.62,4.76 18.1,3.97 19.05,3.97 16.67,4.76 17.14,3.97 16.19,3.97 16.67,3.17 17.62,3.17 18.57,3.17 19.53,3.17 19.05,2.38 18.1,2.38 17.14,2.38 16.19,2.38 16.67,1.59 17.62,1.59 18.57,1.59 19.53,1.59 15.72,1.59
  pour Top (rank 5, no thermals): 14.76,18.1 14.76,0 20.32,0 20.32,14.29 23.65,14.29 23.65,16.07 21.62,18.1
  pour Bottom (rank 5, no thermals): 20.32,0 14.76,0 14.76,18.41 20.32,18.41
M1_MISO  (via drill 0.38)
  Top 0.152: v46.67,6.14 U1.35
  Top 0.356: U5.8 v30.23,13.81
  Bottom 0.254: v30.23,13.81 39,13.81 v46.67,6.14
M1_MOSI  (via drill 0.38)
  Top 0.152: v47.62,6.96 47.94,6.64 U1.36
  Top 0.356: U5.10 v27.88,14.45
  Bottom 0.254: v27.88,14.45 40.14,14.45 v47.62,6.96
M1_NSS  (via drill 0.38)
  Top 0.305: U1.39 v47.78,8.14
  Top 0.356: U5.11 v27.08,15.08
  Bottom 0.254: v27.08,15.08 40.84,15.08 v47.78,8.14
M1_PWM  (via drill 0.38)
  Top 0.254: U1.27 v44.43,4.45
  Top 0.356: U5.6 v31.75,11.36
  Bottom 0.254: v31.75,11.36 32.45,11.36 32.7,11.11 37.76,11.11 v44.43,4.45
M1_SCK  (via drill 0.38)
  Top 0.152: v47.62,5.32 47.94,5.64 U1.34
  Top 0.356: U5.9 v28.68,13.81
  Bottom 0.254: v28.68,13.81 29.31,13.18 38.26,13.18 46.27,5.16 47.47,5.16 v47.62,5.32
M1_TACHO  (via drill 0.38)
  Top 0.254: U1.30 v45.93,4.45
  Top 0.356: U5.7 32.23,12.16 v32.38,12
  Bottom 0.254: v45.93,4.45 45.3,5.08 44.45,5.08 37.94,11.59 33.02,11.59 32.61,12 v32.38,12
M_A
  pour Top (rank 4, no thermals): 59.21,0.48 62.55,0.48 62.55,3.65 65.09,3.65 65.09,1.43 65.56,1.43 65.56,3.65 69.85,3.65 69.85,6.51 61.59,6.51 61.59,2.86 59.21,2.86
M_B
  pour Top (rank 4, no thermals): 61.59,6.83 69.85,6.83 69.85,9.68 65.56,9.68 65.56,11.92 65.09,11.92 65.09,9.68 62.55,9.68 62.55,12.54 59.21,12.54 59.21,10.48 61.59,10.48
M_X
  pour Top (rank 4, no thermals): 59.21,12.86 62.55,12.86 62.55,15.72 65.09,15.72 65.09,13.49 65.56,13.49 65.56,15.72 69.85,15.72 69.85,18.57 61.59,18.57 61.59,14.92 59.21,14.92
M_Y
  pour Top (rank 4, no thermals): 61.59,18.89 69.85,18.89 69.85,21.75 65.56,21.75 65.56,23.98 65.09,23.98 65.09,21.75 62.55,21.75 62.55,24.92 59.21,24.92 59.21,22.54 61.59,22.54
MTR_A  (via drill 0.38)
  Top 0.203: v50.8,8.26 50.41,8.64 U1.40 | v58.84,0.79 U6.22
  Bottom 0.203: v58.84,0.79 58.55,0.5 54.55,0.5 54.29,0.76 54.29,5.4 53.34,6.35 51.91,6.35 50.8,7.46 v50.8,8.26
MTR_B
  Top 0.203: U1.42 50.6,9.64 52.15,11.19 53.26,11.19 53.98,10.48 53.98,8.98 54.23,8.73 56.26,8.73 56.52,8.98 56.52,9.91 56.77,10.16 58.59,10.16 58.84,10.41 U6.15
MTR_EN  (via drill 0.38)
  Top 0.203: v56.99,21.91 58.09,21.91 58.34,22.16 U3.16
  Top 0.305: U3.20 U3.21 v58.34,12.7 U6.16 | U6.21 U6.20 57.84,3.3 57.65,3.49 v56.99,3.49 54.23,3.49 53.98,3.75 53.98,5.71 53.34,6.35 52.07,6.35 50.86,5.14 U1.33
  Bottom 0.203: 58.04,12.7 v58.34,12.7
  Bottom 0.305: v56.99,21.91 56.99,12.95 57.24,12.7 | v56.99,3.49 56.99,12.45 57.24,12.7 | 57.24,12.7 v58.34,12.7
MTR_X
  Top 0.203: U1.43 50.46,10.14 51.99,11.67 53.13,11.67 54.4,12.94 56.02,12.94 56.83,13.75 56.83,15.14 57.09,15.4 58.59,15.4 58.84,15.14 U3.22
MTR_Y  (via drill 0.38)
  Top 0.203: v58.84,24.64 U3.15 | U1.45 49.72,11.14 50.09,11.51 51.26,11.51 51.51,11.76 v51.51,12.09
  Bottom 0.203: v58.84,24.64 58.59,24.9 54.29,24.9 54.29,20.82 50.51,20.82 49.51,19.82 49.51,16.88 51.51,14.87 v51.51,12.09
N$1
  Top 0.305: 36.26,9.19 36.51,9.44 36.51,9.89 36.77,10.14 U1.6
  Top 0.406: X1.3 36.26,9.19
N$2
  Top 0.305: 36.26,11.59 36.51,11.34 36.51,10.89 36.77,10.64 U1.5
  Top 0.406: X1.1 36.26,11.59
N$3
  Top 0.254: U1.47 VCAP2.1
N$4
  Top 0.254: VCAP1.1 46.43,1.73 U1.31
N$5
  Top 0.406: R1.1 LEDQ.+
N$6
  Top 0.406: C4.1 R4.1 23.43,22.07 U2.14
N$7
  Top 0.406: R4.2 22.79,22.88 C6.1
N$8
  Top 0.305: U4.1 48.03,21.98 C2.1
N$9
  Top 0.508: C9.1 40.32,23.09 U7.5
N$11
  Top 0.406: LEDP.+ R3.1
N$22
  pour Top (rank 4, no thermals): 43.81,22.54 45.09,23.81 46.99,23.81 46.99,22.54 47.62,22.54 47.62,21.27 48.58,21.27 48.58,20.64 47.62,20.64 47.62,20.32 43.81,20.32
N$24
  Top 0.406: C17.1 26.28,4.29 U5.29
N$25
  Top 0.406: C17.2 25.48,3.98 U5.28
N$26
  Top 0.305: C18.1 24.68,2.32 U5.27
N$28
  Top 0.305: R7.2 51.98,20.95 | U4.8 U4.7 51.48,20.45 R7.2 | R7.2 C5.1
N$29
  Top 0.305: R7.1 51.71,19.95 U4.6
N$30
  Top 0.229: S1.G 9.5,6.83 14.54,6.83 14.8,6.57 14.8,5.64 14.99,5.45 15.93,5.45 16.03,5.56 18.79,5.56 20.59,7.36 U5.24
N$31
  Top 0.406: S2.G 18.49,6.11 20.54,8.16 U5.23
N$35
  Top 0.406: R2.1 LEDR.+
N$37
  Top 0.406: C19.1 23.88,4 U5.26
N$39
  Top 0.229: S3.G 9.5,12.86 14.54,12.86 14.8,12.61 14.8,11.67 14.99,11.48 15.93,11.48 16.03,11.59 19.37,11.59 20.4,10.56 U5.20
N$40
  Top 0.406: S4.G 19.61,12.14 20.39,11.36 U5.19
N$41
  Top 0.406: C20.1 19.84,8.96 U5.22
N$42
  Top 0.229: U5.18 20.38,12.16 19.79,12.75 15.24,12.75 14.74,13.24 8.38,13.24 8.12,13.5 8.12,17.51 S5.G
N$44
  Top 0.406: S6.G 21.36,18.17 23.88,15.65 U5.15
N$45
  Top 0.406: C21.1 21.48,13.84 U5.17
N$48
  Top 0.406: U5.2 31.88,8.16 R10.1
PWM_AB  (via drill 0.38)
  Top 0.203: U1.41 v51.12,9.14 | v53.82,11.48 54.88,12.54 57.59,12.54 57.84,12.29 U6.17
  Bottom 0.203: v51.12,9.14 51.12,10.48 52.07,11.43 53.77,11.43 v53.82,11.48
PWM_XY  (via drill 0.38)
  Top 0.203: U1.44 50.09,10.64 v50.32,10.87 | U3.17 57.84,24.64 57.59,24.9 52.88,24.9 v52.31,24.33
  Bottom 0.203: v50.32,10.87 50.32,11.75 51.12,12.54 51.12,14.76 49.13,16.75 49.13,20 52.31,23.18 v52.31,24.33
RX_PPM
  Top 0.254: JP1.3 49.69,15.72 47.72,15.72 47.47,15.46 47.47,13.91 47.21,13.65 46.68,13.65 46.43,13.91 U1.50
SWCLK
  Top 0.203: J1.TCK 35.56,16.99 35.81,16.74 41.43,16.74 42.32,15.85 44.32,15.85 44.68,15.49 46.68,15.49 46.93,15.24 U1.49
SWDIO  (via drill 0.38)
  Top 0.203: J1.TMS v37.62,18.61 | U1.46 v47.78,11.64
  Bottom 0.203: v37.62,18.61 40.82,18.61 v47.78,11.64
SWO
  Top 0.203: J1.TDO 34.29,16.62 34.54,16.36 41.29,16.36 42.16,15.49 43.68,15.49 43.93,15.24 U1.55
UART_RX
  Top 0.203: U1.38 51.14,7.64 52.7,9.21 JP2.4
UART_TX
  Top 0.203: U1.37 52.23,7.14 JP2.3
V+  (via drill 0.51)
  Top 0.203: C1.1 51.33,24.11 51.05,24.39 47.59,24.39 47.31,24.11 47.31,22.86 47.44,22.73 47.44,21.71 47.7,21.45 U4.2
  Top 0.305: C1.1 51.33,22.75 51.01,22.35 U4.10
  Top 0.356: U6.13 59.84,6.94 U6.HS_AB 59.84,6.39 U6.24 | U3.13 59.84,19.01 U3.HS_AB 59.84,18.46 U3.24
  Top 0.813: C24.1 53.24,23.88 52.78,23.42 C1.1
  other vias: 58.18,9.05 59.13,9.05 60.09,9.05 61.04,9.05 60.56,8.26 59.61,8.26 58.66,8.26 58.18,7.46 59.13,7.46 60.09,7.46 61.04,7.46 60.56,6.67 59.61,6.67 58.66,6.67 58.18,5.87 59.13,5.87 60.09,5.87 61.04,5.87 60.56,5.08 59.61,5.08 58.66,5.08 61.04,4.29 60.09,4.29 59.13,4.29 58.18,4.29 58.18,21.11 59.13,21.11 60.09,21.11 61.04,21.11 60.56,20.32 59.61,20.32 58.66,20.32 58.18,19.53 59.13,19.53 60.09,19.53 61.04,19.53 60.56,18.73 59.61,18.73 58.66,18.73 58.18,17.94 59.13,17.94 60.09,17.94 61.04,17.94 60.56,17.14 59.61,17.14 58.66,17.14 61.04,16.35 60.09,16.35 59.13,16.35 58.18,16.35 68.26,12.7 68.26,13.65 68.26,14.61 68.26,11.75 68.26,10.79 67.47,11.27 67.47,10.32 67.47,12.22 67.47,13.18 67.47,14.13 67.47,15.08 66.67,14.61 66.67,13.65 66.67,12.7 66.67,11.75 66.67,10.79 69.06,10.32 69.06,11.27 69.06,12.22 69.06,13.18 69.06,14.13 69.06,15.08 57.71,8.26 57.71,6.67 57.71,5.08 57.71,17.14 57.71,18.73 57.71,20.32
  pour Top (rank 6, no thermals): 54.44,25.4 62.4,25.4 62.4,0 59.53,0 59.53,3.17 54.44,3.17
  pour Bottom (rank 4, no thermals): 69.85,21.75 56.99,21.75 56.99,3.65 69.85,3.65
  pour Top (rank 5, no thermals): 66.36,15.72 69.85,15.72 69.85,9.68 66.36,9.68
V-  (via drill 0.38, 0.51)  (1 unrouted)
  Bottom 0.203: v66.67,22.54 64.29,22.54
  Bottom 0.813: v50.16,17.46 v50.16,18.57 50.16,19.53 50.8,20.16 v54.77,20.16
  other vias: 63.18,24.61 64.77,24.61 66.67,23.5 66.67,24.45 67.63,24.45 68.58,24.45 67.63,23.5 67.63,22.54 68.58,23.5 68.58,22.54 63.98,24.61 63.5,22.38 64.29,22.38 66.67,1.91 66.67,2.86 67.63,2.86 68.58,2.86 67.63,1.91 67.63,0.95 66.67,0.95 68.58,1.91 68.58,0.95 55.24,20.8 55.72,20.16 55.24,19.53 54.77,18.89 55.72,18.89 55.24,9.37 55.72,10 54.77,10 55.24,10.64 55.72,11.27 54.77,11.27 64.77,0.79 63.18,0.79 63.98,0.79 64.29,3.02 63.5,3.02 55.09,1.75 55.09,2.7 55.72,2.22 56.36,1.75 56.36,2.7
  pour Top (rank 3, no thermals): 47.62,21.43 47.62,24.37 50.96,24.37 51.28,24.05 51.28,22.7 50.96,22.3 50.96,16.67 47.62,16.67 47.62,20.48 48.74,20.48 48.74,21.43
  pour Top (rank 6, no thermals): 62.7,25.4 69.85,25.4 69.85,0 62.7,0
  pour Top (rank 5, no thermals): 54.45,21.11 56.04,21.11 56.04,18.57 54.45,18.57
  pour Top (rank 5, no thermals): 54.45,11.59 56.04,11.59 56.04,9.05 54.45,9.05
  pour Bottom (rank 5, no thermals): 69.85,0 69.85,25.4 54.44,25.4 54.44,0
  pour Top (rank 6, no thermals): 54.45,3.02 59.21,3.02 59.21,0 54.45,0
  pour Top (rank 6, no thermals): 50.8,18.41 51.44,18.41 51.44,17.78 50.8,17.78
VDD  (via drill 0.57)
  Top 0.254: 36.31,6.64 C_VA.1 35.33,7.62 34.45,7.62 32.31,9.76 U5.4 | C_V2.1 46.93,1.72 U1.32 | U1.48 48.9,12.65
  Top 0.305: 36.31,6.64 U1.13 39.43,6.64 | 48.9,12.65 C_V3.1 | U1.32 50.81,3.19 JP2.2 | U1.48 v47.78,12.64 47.43,12.64 40.43,5.64 | 39.43,6.64 U1.64 38.49,14.59 C_V4.1 37.48,13.55 U1.1 | C_V2.1 47.06,0.89 46.8,0.64 40.67,0.64 40.41,0.89 C_V1.1 40.43,1.6 U1.19 40.43,5.64 | 39.43,6.64 40.43,5.64
  Top 0.406: U2.5 U2.4 | U2.5 26.22,20.77 25.57,21.42 U2.15 U2.16 U2.1 24.9,18.38 C7.1 | U2.5 28.39,20.77 | 28.39,20.77 28.82,21.2 28.82,24.19 29.08,24.45 36.58,24.45 36.83,24.19 | U5.4 U5.3 | 28.39,20.77 28.89,20.27 C8.1 | C15.1 v44.13,23.64
  Top 0.508: 41.37,23.64 C9.2 41.27,23.4 U7.6 | 41.37,23.64 C15.1 | 41.37,23.64 40.56,24.45 37.08,24.45 36.83,24.19 J1.VDD
  Bottom 0.406: v44.13,23.64 44.13,16.29 v47.78,12.64

### Text on the board
tPlace: GYR | PROG | - | SET | 5 | < | > | P | Q | 3 | R | -
bPlace: - | - | Xo Wang | xw@xowang.com | Y | + | X | W | + | V | B | A | U | -
tStop: v0.2